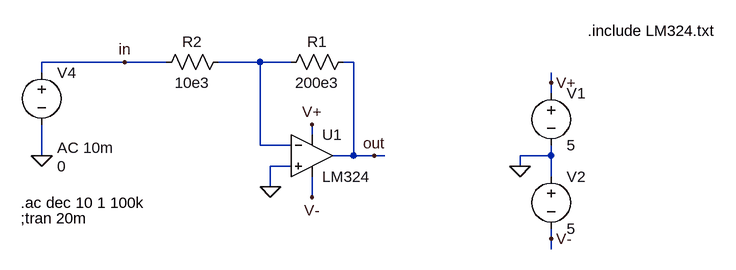
[diagram p0: schematic Aufgabe_1.1.asc]
Aufgabe_1.1.asc, the LTspice schematic file:
Version 4
SHEET 1 880 680
WIRE -96 0 -224 0
WIRE -32 0 -96 0
WIRE 112 0 48 0
WIRE 160 0 112 0
WIRE 256 0 240 0
WIRE -224 16 -224 0
WIRE 560 32 560 16
WIRE 560 48 560 32
WIRE 192 112 192 96
WIRE 112 128 112 0
WIRE 160 128 112 128
WIRE -224 144 -224 96
WIRE 256 144 256 0
WIRE 256 144 224 144
WIRE 288 144 256 144
WIRE 304 144 288 144
WIRE 560 144 560 128
WIRE 560 144 512 144
WIRE 160 160 128 160
WIRE 512 160 512 144
WIRE 560 176 560 144
WIRE 128 192 128 160
WIRE 192 208 192 176
WIRE 560 272 560 256
WIRE 560 288 560 272
FLAG 512 160 0
FLAG 560 32 V+
FLAG 560 272 V-
FLAG 192 96 V+
FLAG 192 208 V-
FLAG 288 144 out
FLAG -224 144 0
FLAG 128 192 0
FLAG -96 0 in
SYMBOL Opamps\\opamp2 192 80 R0
SYMATTR InstName U1
SYMATTR Value LM324
SYMBOL voltage 560 32 R0
WINDOW 123 0 0 Left 2
WINDOW 39 0 0 Left 2
SYMATTR InstName V1
SYMATTR Value 5
SYMBOL voltage 560 160 R0
WINDOW 123 0 0 Left 2
WINDOW 39 0 0 Left 2
SYMATTR InstName V2
SYMATTR Value 5
SYMBOL res 256 -16 R90
WINDOW 0 0 56 VBottom 2
WINDOW 3 32 56 VTop 2
SYMATTR InstName R1
SYMATTR Value 200e3
SYMBOL res 64 -16 R90
WINDOW 0 0 56 VBottom 2
WINDOW 3 32 56 VTop 2
SYMATTR InstName R2
SYMATTR Value 10e3
SYMBOL voltage -224 0 R0
WINDOW 123 24 132 Left 2
WINDOW 39 0 0 Left 2
WINDOW 3 24 160 Left 2
SYMATTR Value2 AC 10m
SYMATTR Value 0
SYMATTR InstName V4
TEXT 616 -48 Left 2 !.include LM324.txt
TEXT -256 240 Left 2 !;tran 20m
TEXT -256 216 Left 2 !.ac dec 10 1 100k

The netlist it stands for:
* Aufgabe_1.1.asc
XU1 0 N001 V+ V- out LM324  ; pins In+ In- V+ V- OUT
V1 V+ 0 5
V2 0 V- 5
R1 out N001 200e3
R2 N001 in 10e3
V4 in 0 0 AC 10m
.include LM324.txt
;tran 20m
.ac dec 10 1 100k
.backanno
.end